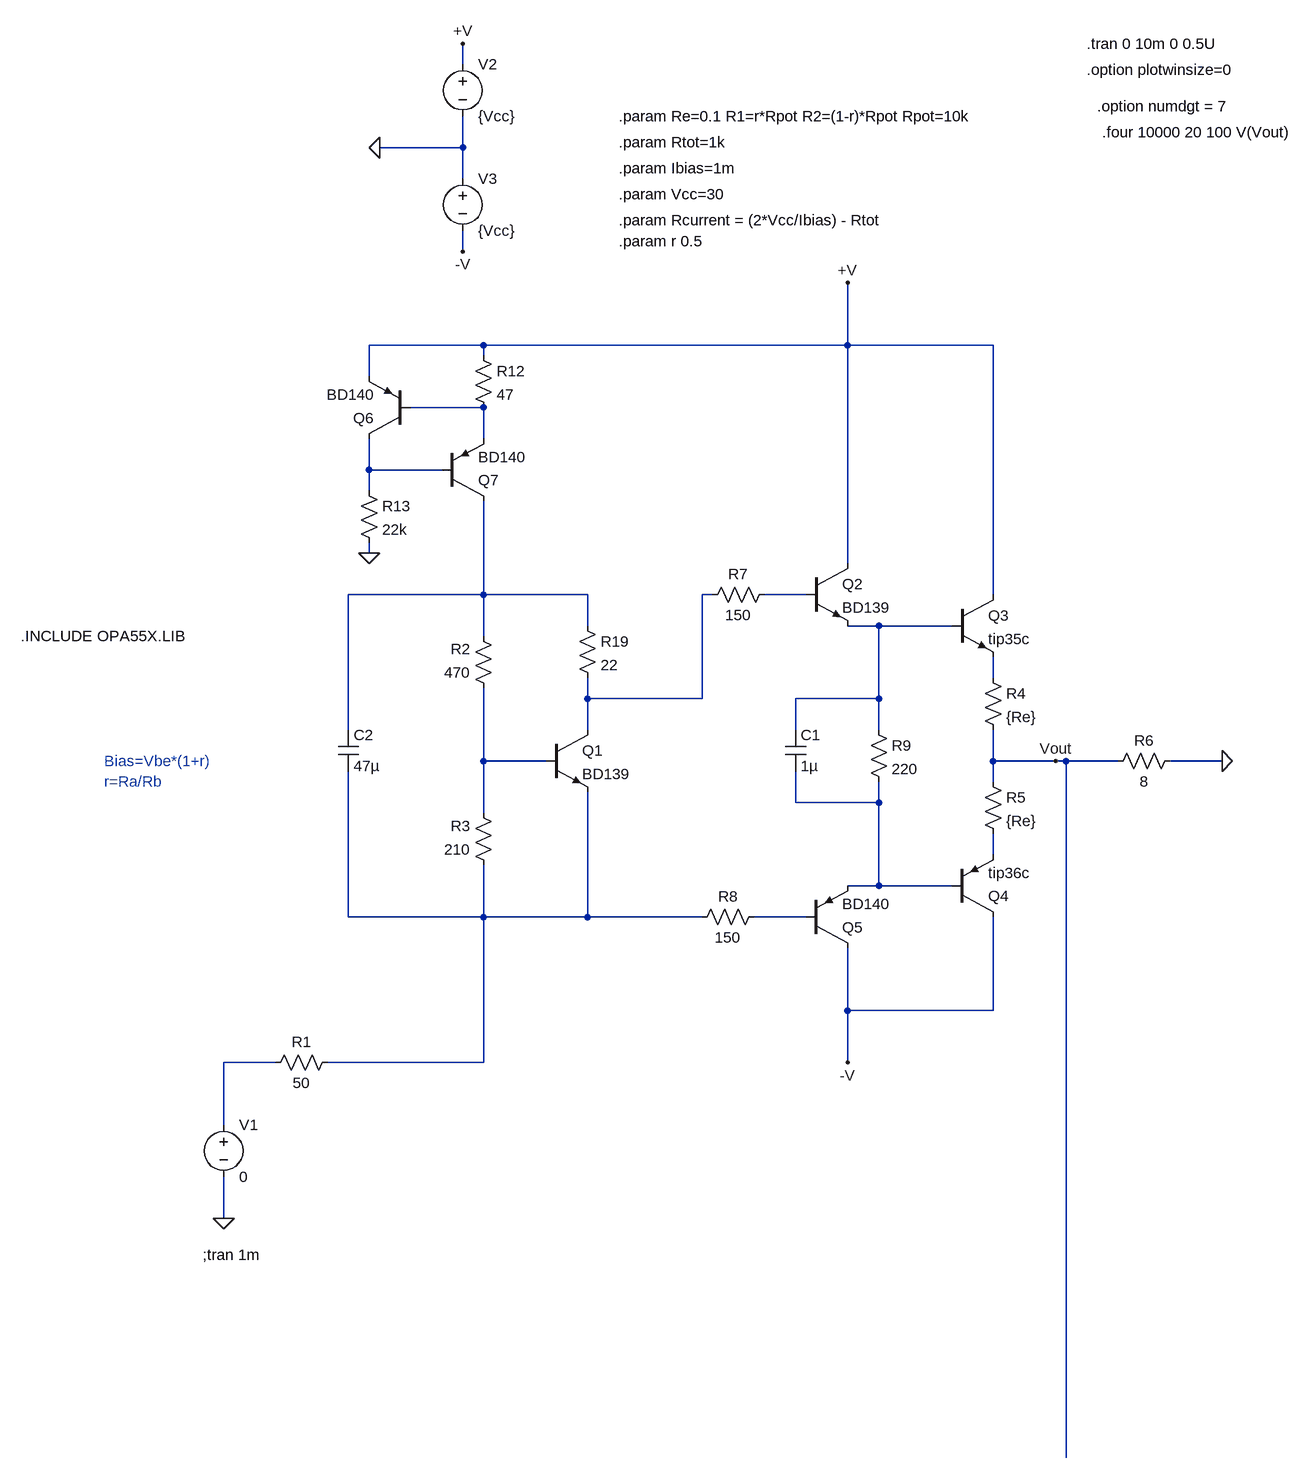
[diagram p0: schematic V3 test.asc]
V3 test.asc, the LTspice schematic file:
Version 4
SHEET 1 1288 1284
WIRE -16 -1072 -16 -1104
WIRE -16 -944 -16 -992
WIRE -16 -944 -144 -944
WIRE -16 -896 -16 -944
WIRE -16 -784 -16 -816
WIRE 16 -640 -160 -640
WIRE 576 -640 576 -736
WIRE 576 -640 16 -640
WIRE 800 -640 576 -640
WIRE 16 -624 16 -640
WIRE -160 -592 -160 -640
WIRE 16 -544 -96 -544
WIRE 16 -496 16 -544
WIRE -160 -448 -160 -496
WIRE -48 -448 -160 -448
WIRE -160 -416 -160 -448
WIRE -160 -320 -160 -336
WIRE 576 -304 576 -640
WIRE 16 -256 16 -400
WIRE 16 -256 -192 -256
WIRE 176 -256 16 -256
WIRE 368 -256 352 -256
WIRE 512 -256 448 -256
WIRE 800 -256 800 -640
WIRE 176 -208 176 -256
WIRE 624 -208 576 -208
WIRE 736 -208 624 -208
WIRE 16 -192 16 -256
WIRE 800 -128 800 -160
WIRE 176 -96 176 -128
WIRE 352 -96 352 -256
WIRE 352 -96 176 -96
WIRE 624 -96 624 -208
WIRE 624 -96 496 -96
WIRE -192 -48 -192 -256
WIRE 176 -48 176 -96
WIRE 496 -48 496 -96
WIRE 624 -48 624 -96
WIRE 16 0 16 -112
WIRE 112 0 16 0
WIRE 800 0 800 -48
WIRE 896 0 800 0
WIRE 912 0 896 0
WIRE 992 0 912 0
WIRE 1152 0 1072 0
WIRE 800 32 800 0
WIRE 496 64 496 16
WIRE 624 64 624 32
WIRE 624 64 496 64
WIRE 16 80 16 0
WIRE 800 144 800 112
WIRE 624 192 624 64
WIRE 624 192 576 192
WIRE 736 192 624 192
WIRE -192 240 -192 16
WIRE 16 240 16 160
WIRE 16 240 -192 240
WIRE 176 240 176 48
WIRE 176 240 16 240
WIRE 352 240 176 240
WIRE 512 240 432 240
WIRE 576 384 576 288
WIRE 800 384 800 240
WIRE 800 384 576 384
WIRE -304 464 -384 464
WIRE 16 464 16 240
WIRE 16 464 -224 464
WIRE 576 464 576 384
WIRE -384 560 -384 464
WIRE -384 704 -384 640
WIRE 912 1072 912 0
FLAG 576 -736 +V
FLAG 576 464 -V
FLAG -384 704 0
FLAG -144 -944 0
FLAG -16 -1104 +V
FLAG -16 -784 -V
FLAG 1152 0 0
FLAG 896 0 Vout
FLAG -160 -320 0
SYMBOL voltage -384 544 R0
WINDOW 123 0 0 Left 0
WINDOW 39 0 0 Left 0
SYMATTR InstName V1
SYMATTR Value 0
SYMBOL res -208 448 R90
WINDOW 0 0 56 VBottom 2
WINDOW 3 32 56 VTop 2
SYMATTR InstName R1
SYMATTR Value 50
SYMBOL res 32 -96 R180
WINDOW 0 36 76 Left 2
WINDOW 3 36 40 Left 2
SYMATTR InstName R2
SYMATTR Value 470
SYMBOL res 32 176 R180
WINDOW 0 36 76 Left 2
WINDOW 3 36 40 Left 2
SYMATTR InstName R3
SYMATTR Value 210
SYMBOL npn 112 -48 R0
SYMATTR InstName Q1
SYMATTR Value BD139
SYMBOL npn 512 -304 R0
SYMATTR InstName Q2
SYMATTR Value BD139
SYMBOL npn 736 -256 R0
SYMATTR InstName Q3
SYMATTR Value tip35c
SYMBOL pnp 736 240 M180
SYMATTR InstName Q4
SYMATTR Value tip36c
SYMBOL pnp 512 288 M180
SYMATTR InstName Q5
SYMATTR Value BD140
SYMBOL res 784 -144 R0
SYMATTR InstName R4
SYMATTR Value {Re}
SYMBOL res 784 16 R0
SYMATTR InstName R5
SYMATTR Value {Re}
SYMBOL voltage -16 -1088 R0
WINDOW 123 0 0 Left 0
WINDOW 39 0 0 Left 0
SYMATTR InstName V2
SYMATTR Value {Vcc}
SYMBOL voltage -16 -912 R0
WINDOW 123 0 0 Left 0
WINDOW 39 0 0 Left 0
SYMATTR InstName V3
SYMATTR Value {Vcc}
SYMBOL res 1088 -16 R90
WINDOW 0 0 56 VBottom 2
WINDOW 3 32 56 VTop 2
SYMATTR InstName R6
SYMATTR Value 8
SYMBOL res 464 -272 R90
WINDOW 0 0 56 VBottom 2
WINDOW 3 32 56 VTop 2
SYMATTR InstName R7
SYMATTR Value 150
SYMBOL res 448 224 R90
WINDOW 0 0 56 VBottom 2
WINDOW 3 32 56 VTop 2
SYMATTR InstName R8
SYMATTR Value 150
SYMBOL res 608 -64 R0
SYMATTR InstName R9
SYMATTR Value 220
SYMBOL cap 480 -48 R0
SYMATTR InstName C1
SYMATTR Value 1µ
SYMBOL cap -208 -48 R0
SYMATTR InstName C2
SYMATTR Value 47µ
SYMBOL pnp -96 -496 R180
SYMATTR InstName Q6
SYMATTR Value BD140
SYMBOL res 0 -640 R0
SYMATTR InstName R12
SYMATTR Value 47
SYMBOL pnp -48 -400 M180
SYMATTR InstName Q7
SYMATTR Value BD140
SYMBOL res -176 -432 R0
SYMATTR InstName R13
SYMATTR Value 22k
SYMBOL res 160 -224 R0
SYMATTR InstName R19
SYMATTR Value 22
TEXT -568 0 Left 2 ;Bias=Vbe*(1+r)\nr=Ra/Rb
TEXT 224 -952 Left 2 !.param Rtot=1k
TEXT 224 -912 Left 2 !.param Ibias=1m
TEXT 224 -872 Left 2 !.param Vcc=30
TEXT 224 -832 Left 2 !.param Rcurrent = (2*Vcc/Ibias) - Rtot
TEXT -416 760 Left 2 !;tran 1m
TEXT 944 -1104 Left 2 !.tran 0 10m 0 0.5U
TEXT 944 -1064 Left 2 !.option plotwinsize=0
TEXT 960 -1008 Left 2 !.option numdgt = 7
TEXT 968 -968 Left 2 !.four 10000 20 100 V(Vout)
TEXT -696 -192 Left 2 !.INCLUDE OPA55X.LIB
TEXT 224 -992 Left 2 !.param Re=0.1 R1=r*Rpot R2=(1-r)*Rpot Rpot=10k
TEXT 224 -800 Left 2 !.param r 0.5

The netlist it stands for:
* V3 test.asc
V1 N013 0 0
R1 N011 N013 50
R2 N008 N003 470
R3 N011 N008 210
Q1 N004 N008 N011 0 BD139
Q2 +V N005 N006 0 BD139
Q3 +V N006 N007 0 tip35c
Q4 -V N009 N010 0 tip36c
Q5 -V N012 N009 0 BD140
R4 N007 Vout {Re}
R5 Vout N010 {Re}
V2 +V 0 {Vcc}
V3 0 -V {Vcc}
R6 0 Vout 8
R7 N005 N004 150
R8 N012 N011 150
R9 N006 N009 220
C1 N006 N009 1µ
C2 N003 N011 47µ
Q6 N002 N001 +V 0 BD140
R12 +V N001 47
Q7 N003 N002 N001 0 BD140
R13 N002 0 22k
R19 N003 N004 22
.model NPN NPN
.model PNP PNP
.lib standard.bjt
* Bias=Vbe*(1+r)
* r=Ra/Rb
.param Rtot=1k
.param Ibias=1m
.param Vcc=30
.param Rcurrent = (2*Vcc/Ibias) - Rtot
;tran 1m
.tran 0 10m 0 0.5U
.option plotwinsize=0
.option numdgt = 7
.four 10000 20 100 V(Vout)
.INCLUDE OPA55X.LIB
.param Re=0.1 R1=r*Rpot R2=(1-r)*Rpot Rpot=10k
.param r 0.5
.backanno
.end